# EAGLE schematic LightSwitch (EAGLE 8.3.1)
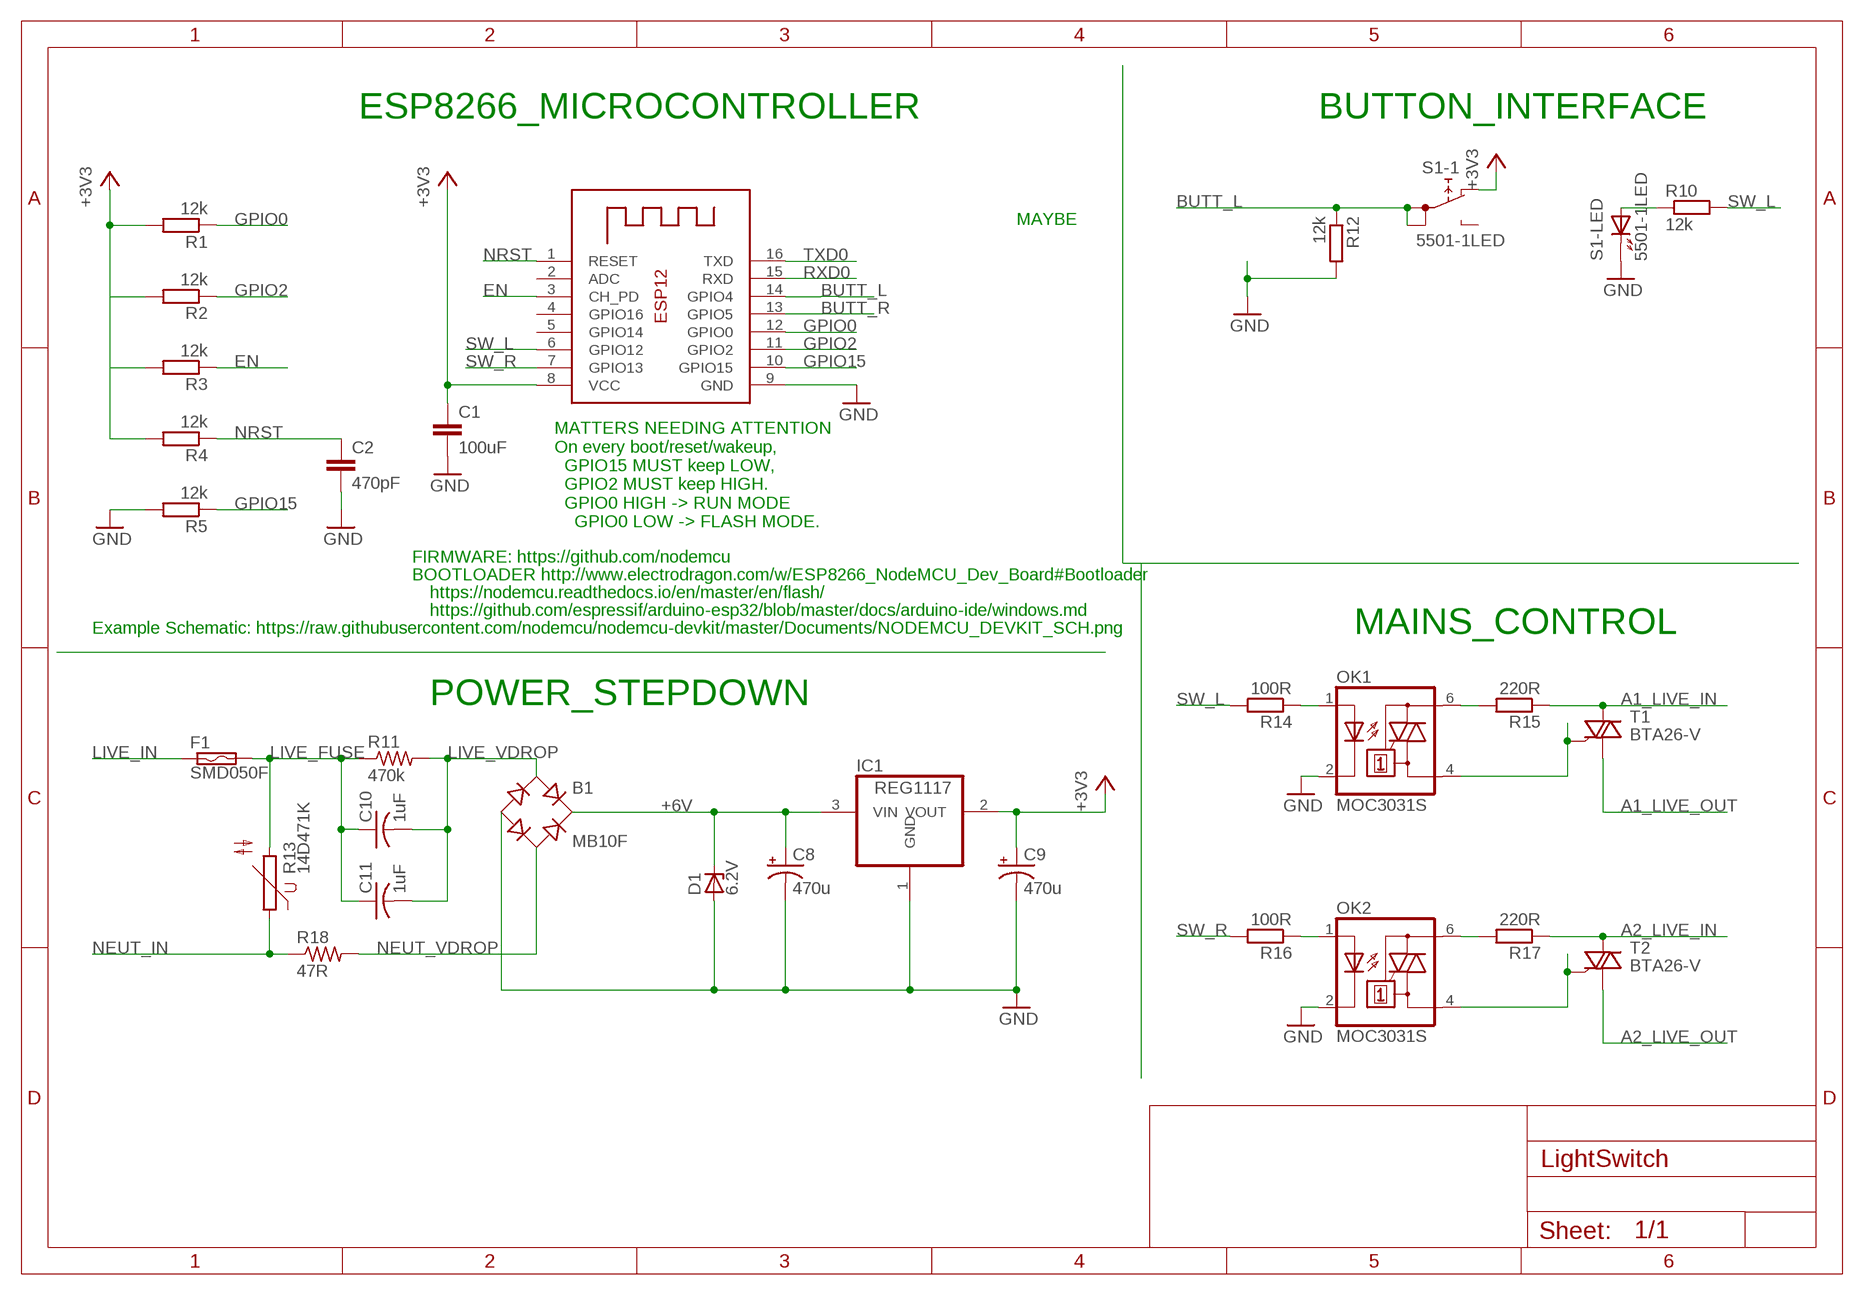
[diagram p0: schematic, sheet 1]

## Parts
B1  MB10F  MB8S  [SOIC-4]
C1  100uF  C-EUC0805K  [C0805K]
C2  470pF  C-EUC0805K  [C0805K]
C8  470u  CPOL-USE3.5-8  [E3,5-8]
C9  470u  CPOL-USE3.5-8  [E3,5-8]
C10  1uF  C-US225-074X268  [C225-074X268]
C11  1uF  C-US225-074X268  [C225-074X268]
D1  6.2V  ZENER-DIODESMB  [SMB]
F1  SMD050F  [SMD050F]
IC1  REG1117  [SOT223]
OK1  MOC3031S  [DIL6-SMD]
OK2  MOC3031S  [DIL6-SMD]
R1  12k  R-EU_M0805  [M0805]
R2  12k  R-EU_M0805  [M0805]
R3  12k  R-EU_M0805  [M0805]
R4  12k  R-EU_M0805  [M0805]
R5  12k  R-EU_M0805  [M0805]
R10  12k  R-EU_M0805  [M0805]
R11  470k  R-US_0309/12  [0309/12]
R12  12k  R-EU_M0805  [M0805]
R13  14D471K  S07K40  [S07K40]
R14  100R  R-EU_M0805  [M0805]
R15  220R  R-EU_M0805  [M0805]
R16  100R  R-EU_M0805  [M0805]
R17  220R  R-EU_M0805  [M0805]
R18  47R  R-US_0309/12  [0309/12]
S1  5501-1LED  [5501-1LED]
T1  BTA26-V  [TOP3S-1]
T2  BTA26-V  [TOP3S-1]
X1  ESP-12  [ESP-12]

## Nets
+3V1: R2.2
+3V2: R3.2
+3V3: C1.1 C9.+ IC1.2(VOUT) R1.2 R4.2 S1.NC(-1:NC) X1.8(VCC)
+6V: B1.+ C8.+ D1.C IC1.3(VIN)
A1_LIVE_IN: R15.1 T1.A2
A1_LIVE_OUT: T1.A1
A2_LIVE_IN: R17.1 T2.A2
A2_LIVE_OUT: T2.A1
BUTT_L: R12.1 S1.1A(-1:1A) S1.1B(-1:1B) X1.14(GPIO4)
BUTT_R: X1.13(GPIO5)
EN: R3.1 X1.3(CH_PD)
GND: B1.- C1.2 C2.2 C8.- C9.- D1.A IC1.1(GND) OK1.2(C) OK2.2(C) R5.2 R12.2 S1.-(-LED:K) X1.9(GND)
GPIO0: R1.1 X1.12(GPIO0)
GPIO2: R2.1 X1.11(GPIO2)
GPIO15: R5.1 X1.10(GPIO15)
LIVE_FUSE: C10.1 C11.1 F1.2 R11.1 R13.2
LIVE_IN: F1.1
LIVE_VDROP: B1.~1(AC1) C10.2 C11.2 R11.2
N$10: R10.1 S1.+(-LED:A)
N$12: OK1.1(A) R14.1
N$13: OK1.6(A2) R15.2
N$14: OK1.4(A1) T1.G
N$15: OK2.1(A) R16.1
N$16: OK2.6(A2) R17.2
N$17: OK2.4(A1) T2.G
NEUT_IN: R13.1 R18.1
NEUT_VDROP: B1.~2(AC2) R18.2
NRST: C2.1 R4.1 X1.1(RESET)
RXD0: X1.15(RXD)
SW_L: R10.2 R14.2 X1.6(GPIO12)
SW_R: R16.2 X1.7(GPIO13)
TXD0: X1.16(TXD)
Unconnected: S1.NO(-1:NO) X1.2(ADC) X1.4(GPIO16) X1.5(GPIO14)

## Notes on the sheet
- ESP8266_MICROCONTROLLER | BUTTON_INTERFACE
- MAYBE
- MATTERS NEEDING ATTENTION
  On every boot/reset/wakeup,
    GPIO15 MUST keep LOW,
    GPIO2 MUST keep HIGH.
    GPIO0 HIGH -> RUN MODE
      GPIO0 LOW -> FLASH MODE.
- FIRMWARE: https://github.com/nodemcu
- BOOTLOADER http://www.electrodragon.com/w/ESP8266_NodeMCU_Dev_Board#Bootloader
- https://nodemcu.readthedocs.io/en/master/en/flash/
- https://github.com/espressif/arduino-esp32/blob/master/docs/arduino-ide/windows.md
- Example Schematic: https://raw.githubusercontent.com/nodemcu/nodemcu-devkit/master/Documents/NODEMCU_DEVKIT_SCH.png | MAINS_CONTROL
- POWER_STEPDOWN

## Library data of the parts
B1 = rectifier:MB*S: Bridge Rectifier Source: http://www.fairchildsemi.com/ds/MB/MB6S.pdf
C1 C2 = rcl:C-EU: CAPACITOR, European symbol
C8 C9 = adafruit:CPOL-US: POLARIZED CAPACITOR, American symbol
C10 C11 = adafruit:C-US: CAPACITOR, American symbol
D1 = diode:ZENER-DIODE: Z-Diode
F1 = switch-raychem:SMD*F: PolySwitch (TM) Resettable Device Source: Data sheet <http://www.farnell.com/datasheets/13482.pdf>
IC1 = burr-brown:REG1117: 800mA and 1A Low Dropout (LDO) Positive Regulator 1.8V, 2.5V, 2.85V, 3.3V, 5V, and Adj; MPN: REG1117; OC_FARNELL: 1097566; OC_NEWARK: 14P6981
OK1 OK2 = optocoupler:MOC30*: 6-Pin DIP Zero-Cross Optoisolators Triac Driver Output (250/400 Volt Peak) Source: Data sheet <http://www.fairchildsemi.com/ds/MO/MOC3031M.pdf> The old path of data sheet not more available 2013-05-06.; MF: FAIRCHILD SEMICONDUCTOR; MPN: MOC3031SM; OC_FARNELL: unknown; OC_NEWARK: 34C1335
R1-R5 R10 R12 R14-R17 = resistor:R-EU_: RESISTOR, European symbol
R11 R18 = adafruit:R-US_: RESISTOR, American symbol
R13 = varistor:S07K40: VARISTOR
S1 = switch:55?-1LED: PUSHBUTTON SERIES 5500 SWITCHES 1 LED Source: www.e-switch.com .. 5500.pdf
T1 T2 = triac:BTA26: 25A TRIAC Source: http://www.st.com/stonline/products/literature/ds/7470.pdf
X1 = adafruit:ESP-12